# EAGLE schematic 7-SEG schematic (EAGLE 6.5.0)
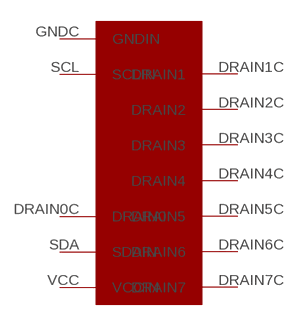
[diagram p0: schematic, sheet 1]

## Parts
U$2  LED_DRIVER_ASSEMBLY_CHIP  [LED_DRIVER_ASSEMBLY_CHIP]
Unconnected: U$2.DRAIN0C(DRAIN0) U$2.DRAIN1C(DRAIN1) U$2.DRAIN2C(DRAIN2) U$2.DRAIN3C(DRAIN3) U$2.DRAIN4C(DRAIN4) U$2.DRAIN5C(DRAIN5) U$2.DRAIN6C(DRAIN6) U$2.DRAIN7C(DRAIN7) U$2.GNDC(GNDIN) U$2.SCL(SCLIN) U$2.SDA(SDAIN) U$2.VCC(VCCIN)

## Library data of the parts
U$2 = Parts:LED_DRIVER_ASSEMBLY_CHIP